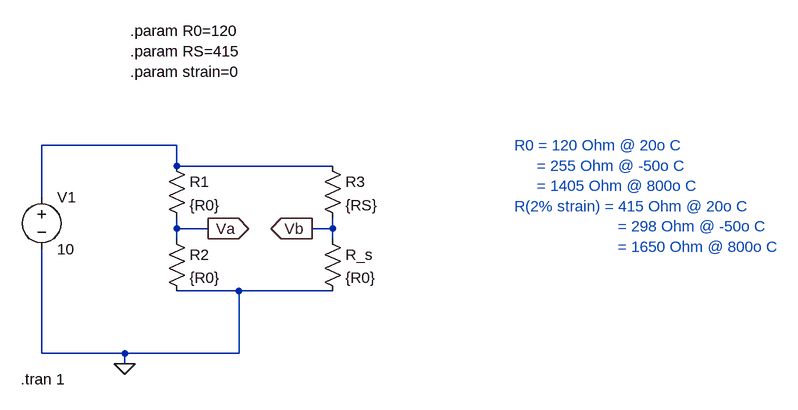
[diagram p0: schematic hw02_ece6140.asc]
hw02_ece6140.asc, the LTspice schematic file:
Version 4.1
SHEET 1 1008 680
WIRE 64 -64 -144 -64
WIRE 64 -32 64 -64
WIRE 304 -32 64 -32
WIRE -144 16 -144 -64
WIRE 64 64 64 48
WIRE 112 64 64 64
WIRE 304 64 304 48
WIRE 304 64 272 64
WIRE 64 80 64 64
WIRE 304 80 304 64
WIRE 160 160 64 160
WIRE 304 160 160 160
WIRE -144 256 -144 96
WIRE -16 256 -144 256
WIRE 160 256 160 160
WIRE 160 256 -16 256
WIRE -16 272 -16 256
FLAG -16 272 0
FLAG 112 64 Va
IOPIN 112 64 Out
FLAG 272 64 Vb
IOPIN 272 64 Out
DATAFLAG 96 64 ""
DATAFLAG 288 64 ""
SYMBOL voltage -144 0 R0
WINDOW 123 0 0 Left 0
WINDOW 39 0 0 Left 0
SYMATTR InstName V1
SYMATTR Value 10
SYMBOL res 48 -48 R0
SYMATTR InstName R1
SYMATTR Value {R0}
SYMBOL res 48 64 R0
SYMATTR InstName R2
SYMATTR Value {R0}
SYMBOL res 288 64 R0
SYMATTR InstName R_s
SYMATTR Value {R0}
SYMBOL res 288 -48 R0
SYMATTR InstName R3
SYMATTR Value {RS}
TEXT 584 -64 Left 2 ;R0 = 120 Ohm @ 20o C \n     = 255 Ohm @ -50o C\n     = 1405 Ohm @ 800o C\nR(2% strain) = 415 Ohm @ 20o C\n                       = 298 Ohm @ -50o C \n                       = 1650 Ohm @ 800o C
TEXT -8 -240 Left 2 !.param R0=120\n.param RS=415\n.param strain=0
TEXT -176 296 Left 2 !.tran 1

The netlist it stands for:
* hw02_ece6140.asc
V1 N001 0 10
R1 N001 Va {R0}
R2 Va 0 {R0}
R_s Vb 0 {R0}
R3 N001 Vb {RS}
* R0 = 120 Ohm @ 20o C
*      = 255 Ohm @ -50o C
*      = 1405 Ohm @ 800o C
* R(2% strain) = 415 Ohm @ 20o C
*                        = 298 Ohm @ -50o C
*                        = 1650 Ohm @ 800o C
.param R0=120
.param RS=415
.param strain=0
.tran 1
.backanno
.end